# Altium schematic sheet MCU.SchDoc
size 381 x 241 mm
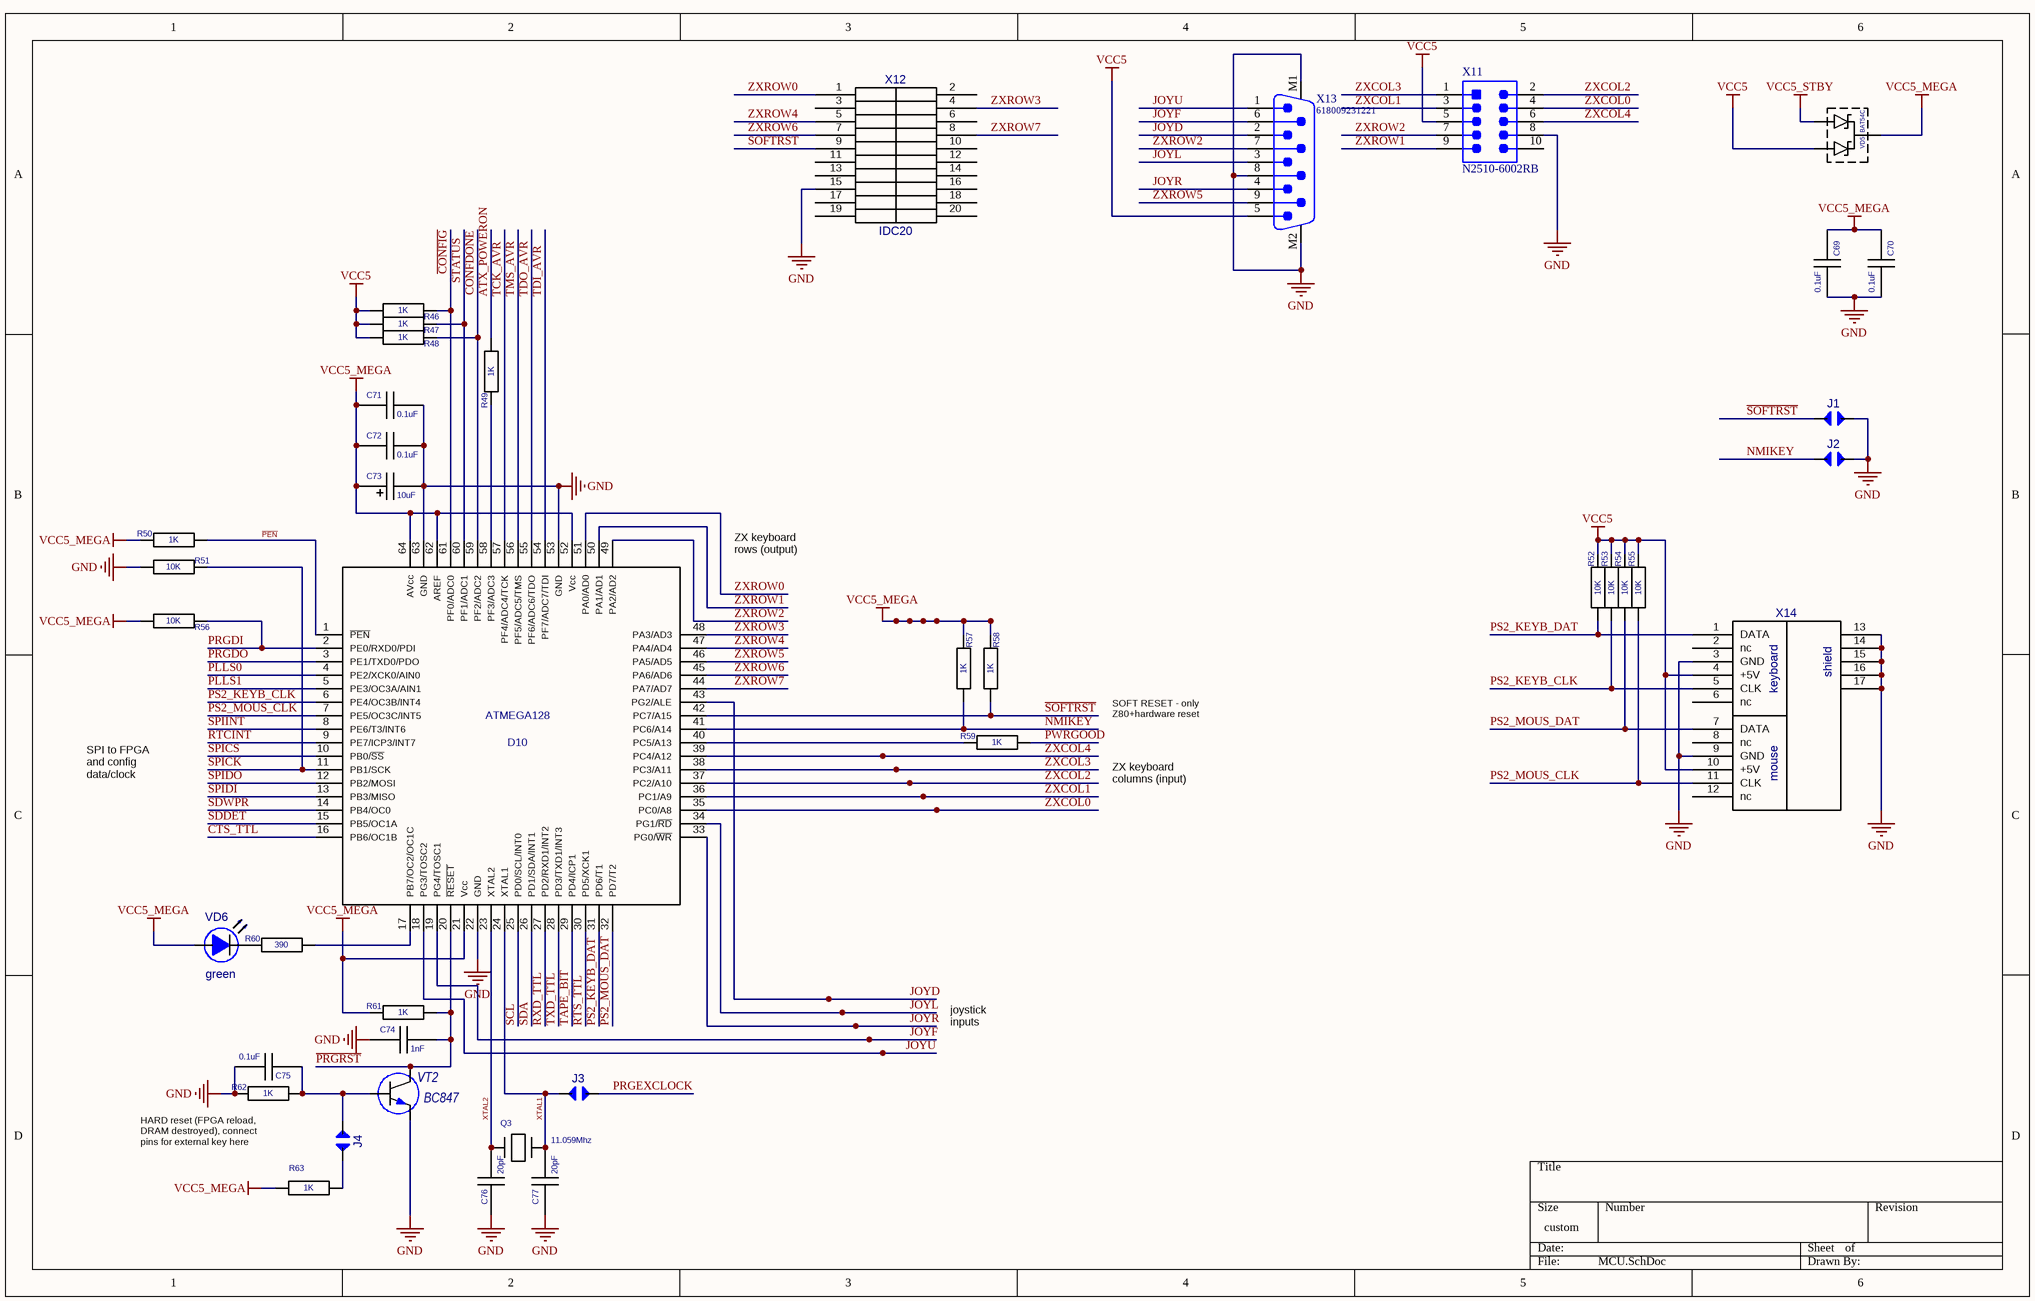
[diagram p0: MCU.SchDoc]

## Parts
C69  value 0.1uF  [C-CHIP]  (hidden comment: CAPCHIP)
C70  value 0.1uF  [C-CHIP]  (hidden comment: CAPCHIP)
C71  value 0.1uF  [C-CHIP]  (hidden comment: CAPCHIP)
C72  value 0.1uF  [C-CHIP]  (hidden comment: CAPCHIP)
C73  value 10uF  [EC-CHIP]  (hidden comment: ECAPCHIP)
C74  value 1nF  [C-CHIP]  (hidden comment: CAPCHIP)
C75  value 0.1uF  [C-CHIP]  (hidden comment: CAPCHIP)
C76  value 20pF  [C-CHIP]  (hidden comment: CAPCHIP)
C77  value 20pF  [C-CHIP]  (hidden comment: CAPCHIP)
D10  ATMEGA128  [TQFP64X8]
J1  JUMPER  [JUMPER]  (value not drawn)
J2  JUMPER  [JUMPER]  (value not drawn)
J3  JUMPER  [JUMPER]  (value not drawn)
J4  JUMPER  [JUMPER]  (value not drawn)
Q3  value 11.059Mhz  [CRYSTAL]  (hidden comment: QUARTZ)
R46  value 1K  [R-CHIP]  (hidden comment: RESCHIP)
R47  value 1K  [R-CHIP]  (hidden comment: RESCHIP)
R48  value 1K  [R-CHIP]  (hidden comment: RESCHIP)
R49  value 1K  [R-CHIP]  (hidden comment: RESCHIP)
R50  value 1K  [R-CHIP]  (hidden comment: RESCHIP)
R51  value 10K  [R-CHIP]  (hidden comment: RESCHIP)
R52  value 10K  [R-CHIP]  (hidden comment: RESCHIP)
R53  value 10K  [R-CHIP]  (hidden comment: RESCHIP)
R54  value 10K  [R-CHIP]  (hidden comment: RESCHIP)
R55  value 10K  [R-CHIP]  (hidden comment: RESCHIP)
R56  value 10K  [R-CHIP]  (hidden comment: RESCHIP)
R57  value 1K  [R-CHIP]  (hidden comment: RESCHIP)
R58  value 1K  [R-CHIP]  (hidden comment: RESCHIP)
R59  value 1K  [R-CHIP]  (hidden comment: RESCHIP)
R60  value 390  [R-CHIP]  (hidden comment: RESCHIP)
R61  value 1K  [R-CHIP]  (hidden comment: RESCHIP)
R62  value 1K  [R-CHIP]  (hidden comment: RESCHIP)
R63  value 1K  [R-CHIP]  (hidden comment: RESCHIP)
VD5  BAT54C  [SOT-23]
VD6  value green  [LED100]  (hidden comment: LED)
VT2  BC847  [SOT-23]
X11  N2510-6002RB  [3M-N2510-6002-10_V]
X12  IDC20  [IDC20]
X13  618009231221  [618009231221]
X14  KEYB-MOUSE  [MDD-6FR]  (value not drawn)

## Nets
GND: C69.2 C70.2 C71.2 C72.2 C73.2 C74.1 C75.2 C76.1 C77.1 D10.22(GND) D10.53(GND) D10.63(GND) J1.1 J2.1 R51.1(i/o) R62.2(i/o1) VT2.2(emitter) X11.8 X12.15 X13.8 X13.M1 X13.M2 X14.3(GND) X14.9(GND) X14.13(shield) X14.14(shield) X14.15(shield) X14.16(shield) X14.17(shield)
VCC5: R46.1(i/o) R47.1(i/o) R48.1(i/o) R52.2(i/o1) R53.2(i/o1) R54.2(i/o1) R55.2(i/o1) VD5.2 X11.5 X13.5 X14.4(+5V) X14.10(+5V)
VCC5_MEGA: C69.1 C70.1 C71.1 C72.1 C73.1 D10.21(Vcc) D10.52(Vcc) D10.62(AREF) D10.64(AVcc) R50.2(i/o1) R56.1(i/o) R57.2(i/o1) R58.2(i/o1) R61.2(i/o1) R63.2(i/o1) VD5.3 VD6.A
VCC5_STBY: VD5.1
ATX_POWERON: R49.1(i/o)
~{CONFIG}: D10.61(PF0/ADC0) R46.2(i/o1)
CONFDONE: D10.59(PF2/ADC2) R48.2(i/o1)
CTS_TTL: D10.16(PB6/OC1B)
JOYD: D10.43(PG2/ALE) X13.2
JOYF: D10.19(PG4/TOSC1) X13.6
JOYL: D10.34(PG1/~{RD}) X13.3
JOYR: D10.33(PG0/~{WR}) X13.4
JOYU: D10.18(PG3/TOSC2) X13.1
NMIKEY: D10.41(PC6/A14) J2.0 R57.1(i/o)
~{PEN}: D10.1(~{PEN}) R50.1(i/o)
~{PRGRST}: C74.2 D10.20(~{RESET}) R61.1(i/o) VT2.3(collector)
PLLS0: D10.4(PE2/XCK0/AIN0)
PLLS1: D10.5(PE3/OC3A/AIN1)
PRGDI: D10.2(PE0/RXD0/PDI) R56.2(i/o1)
PRGDO: D10.3(PE1/TXD0/PDO)
PRGEXCLOCK: J3.1
PS2_KEYB_CLK: D10.6(PE4/OC3B/INT4) R53.1(i/o) X14.5(CLK)
PS2_KEYB_DAT: D10.31(PD6/T1) R52.1(i/o) X14.1(DATA)
PS2_MOUS_CLK: D10.7(PE5/OC3C/INT5) R55.1(i/o) X14.11(CLK)
PS2_MOUS_DAT: D10.32(PD7/T2) R54.1(i/o) X14.7(DATA)
PWRGOOD: R59.1(i/o)
~{RTCINT}: D10.9(PE7/ICP3/INT7)
RTS_TTL: D10.30(PD5/XCK1)
RXD_TTL: D10.27(PD2/RXD1/INT2)
~{SOFTRST}: D10.42(PC7/A15) J1.0 R58.1(i/o) X12.9
~{SPICS}: D10.10(PB0/~{SS})
~{SPIINT}: D10.8(PE6/T3/INT6)
~{STATUS}: D10.60(PF1/ADC1) R47.2(i/o1)
SCL: D10.25(PD0/SCL/INT0)
SDA: D10.26(PD1/SDA/INT1)
SDDET: D10.15(PB5/OC1A)
SDWPR: D10.14(PB4/OC0)
SPICK: D10.11(PB1/SCK) R51.2(i/o1)
SPIDI: D10.13(PB3/MISO)
SPIDO: D10.12(PB2/MOSI)
TAPE_BIT: D10.29(PD4/ICP1)
TCK_AVR: D10.57(PF4/ADC4/TCK)
TDI_AVR: D10.54(PF7/ADC7/TDI)
TDO_AVR: D10.55(PF6/ADC6/TDO)
TMS_AVR: D10.56(PF5/ADC5/TMS)
TXD_TTL: D10.28(PD3/TXD1/INT3)
XTAL1: C77.2 D10.24(XTAL1) J3.0 Q3.B
XTAL2: C76.2 D10.23(XTAL2) Q3.A
ZXCOL0: D10.35(PC0/A8) X11.4
ZXCOL1: D10.36(PC1/A9) X11.3
ZXCOL2: D10.37(PC2/A10) X11.2
ZXCOL3: D10.38(PC3/A11) X11.1
ZXCOL4: D10.39(PC4/A12) X11.6
ZXROW0: D10.51(PA0/AD0) X12.1
ZXROW1: D10.50(PA1/AD1) X11.9
ZXROW2: D10.49(PA2/AD2) X11.7 X13.7
ZXROW3: D10.48(PA3/AD3) X12.4
ZXROW4: D10.47(PA4/AD4) X12.5
ZXROW5: D10.46(PA5/AD5) X13.9
ZXROW6: D10.45(PA6/AD6) X12.7
ZXROW7: D10.44(PA7/AD7) X12.8
NetC75_1: C75.1 J4.0 R62.1(i/o) VT2.1(base)
NetD10_17: D10.17(PB7/OC2/OC1C) R60.1(i/o)
NetD10_40: D10.40(PC5/A13) R59.2(i/o1)
NetD10_58: D10.58(PF3/ADC3) R49.2(i/o1)
NetJ4_1: J4.1 R63.1(i/o)
NetR60_2: R60.2(i/o1) VD6.K

Not connected (* = marked no-connect by the designer): X11 10; X12 2 3 6 10 11 12 13 14 16 17 18 19 20; X14 2(nc) 6(nc) 8(nc) 12(nc)

## Notes on the sheet
- ZX keyboard
  rows (output)
- SOFT RESET - only
  Z80+hardware reset
- SPI to FPGA
  and config
  data/clock
- ZX keyboard
  columns (input)
- joystick
  inputs
- HARD reset (FPGA reload,
  DRAM destroyed), connect
  pins for external key here
- (in symbol KEYB-MOUSE) keyboard; mouse

## Library data of the parts
J1 = JUMPER: Soft Reset Key
J2 = JUMPER: NMI Key; Value: *
J3 = JUMPER: externalclock; Value: *
J4 = JUMPER: Hard Reset Key; Value: *
Q3 = QUARTZ: Crystal
VD6 = LED: Light Emitting Diode
X11 = CMP-2000-06794-1: Male Header, Pitch 2.54 mm, 2 x 5 Postion, Height 9.91 mm, Tail Length 2.84 mm, -55 to 105 degC, RoHS, Bulk; PartNumber: N2510; Manufacturer: 3M; Package Version: Rev. M, 08/2014; Rad Hard: No; No. of Rows: 2; Number of Contacts: 10; Pitch: 2.54mm; Termination Method: Solder; Manufacturer URL: http://www.3m.com/; Package Description: 10-Pin Through Hole Device, Body 20.02 x 8.59 mm, Pitch 2.54 mm; Gender: Male; Number of Rows: 2; Orientation: Straight; Contact Plating: GoldOverNickel; Packaging: Rail/Tube; Mounting Technology: ThroughHole; Datasheet URL: https://datasheet.ciiva.com/11746/0900766b807b18da-11746957.pdf; Package Reference: N2510-6002-10; Datasheet Version: 05/2007; No. of Positions: 10; Package URL: http://multimedia.3m.com/mws/media/330367O/3mtm-100-in-4-wall-hdr-rohs-lp-straightra-hitemp-ts0770.pdf; Type: ShroudedHeader
X13 = CMP-1502-00284-1: Male PCB Connector with Hex Screw WR-DSUB, 8.08 mm, Angled, 9 pins; Manufacturer: Wurth Elektronik; Working Voltage: 125VAC; Contact Resistance: 30mOhm; Rated Current: 3A; Pin Number: 9; Manufacturer URL: http://www.we-online.de; Orientation: Angled; Operating Temperature: -40to85degC; Package Reference: 618009231221; Gender: Male; Mounting Technology: THT; Publisher: WurthElektronik; Datasheet URL: https://katalog.we-online.de/em/datasheet/6180xx231221.pdf; Part Number: 618009231221; Packaging: Tray
D10 = ATMEGA128: Value: *
VD5 = BAT54C: Value: *
X12 = IDC20: Value: *
X14 = KEYB-MOUSE: Value: *